# Altium schematic sheet contor.SchDoc
size A3
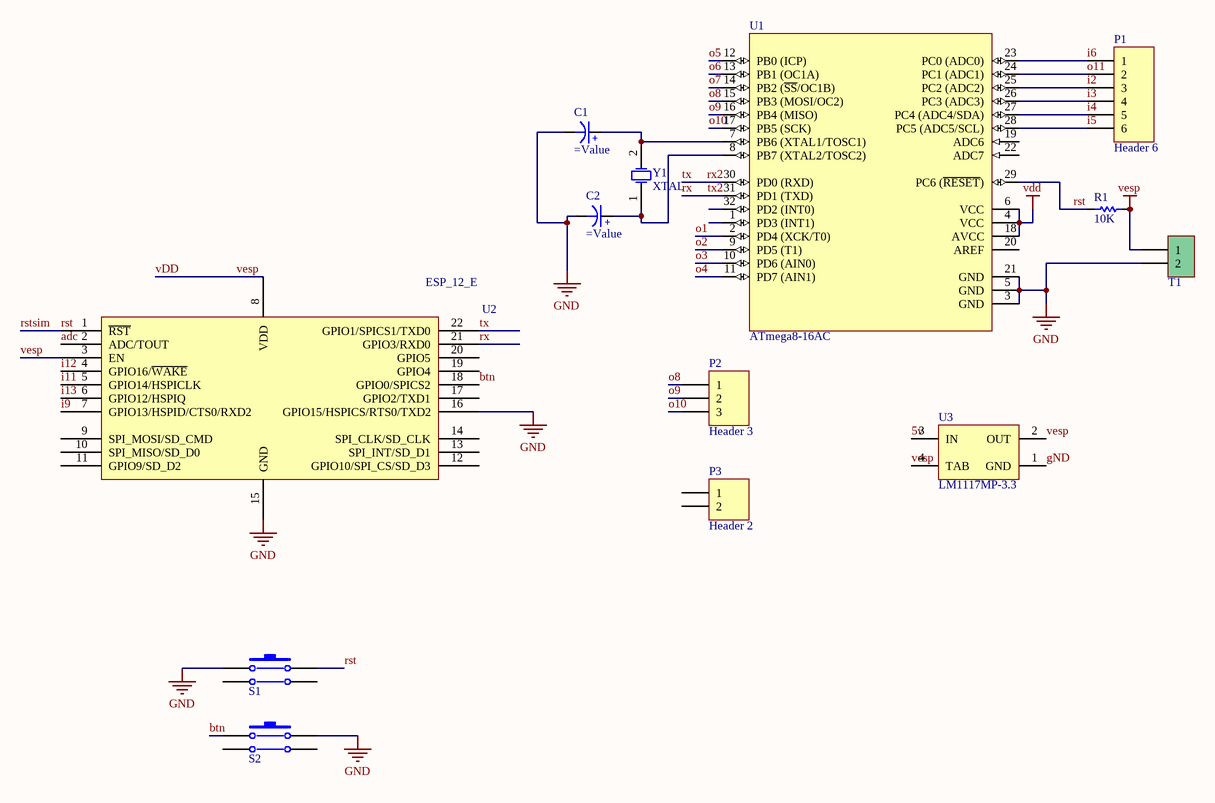
[diagram p0: contor.SchDoc]

## Parts
C1  (no value)  [ELEC-CAP-RAD10-20]
C2  (no value)  [ELEC-CAP-RAD10-20]
P1  Header 6  [HDR1X6]
P2  Header 3  [HDR1X3]
P3  Header 2  [HDR1X2]
R1  10K  [RES 1206 (3216X08L)]
S1  PUSH BUTTON DOUBLE  [PUSH BUTTON]  (value not drawn)
S2  PUSH BUTTON DOUBLE  [PUSH BUTTON]  (value not drawn)
T1  Phoenix terminal  [phoenix terminal R 2]  (value not drawn)
U1  ATmega8-16AC  [32A_N]
U2  ESP_12_E  [ESP_12_E]
U3  LM1117MP-3.3  [MP04A_N]
Y1  XTAL  [R38]

## Nets
gND: C1.1(-) C2.1(-) S1.1 S2.2 T1.2 U1.3(GND) U1.5(GND) U1.21(GND) U2.15(GND) U2.16(GPIO15/HSPICS/RTS0/TXD2) U3.1(GND)
vDD: R1.2 T1.1 U1.4(VCC) U1.6(VCC) U1.18(AVCC) U2.3(EN) U2.8(VDD) U3.2(OUT) U3.4(TAB)  [also labelled vesp]
5v: U3.3(IN)
adc: U2.2(ADC/TOUT)
btn: S2.1 U2.18(GPIO0/SPICS2)
i2: P1.3 U1.25(PC2_(ADC2))
i3: P1.4 U1.26(PC3_(ADC3))
i4: P1.5 U1.27(PC4_(ADC4/SDA))
i5: P1.6 U1.28(PC5_(ADC5/SCL))
i6: P1.1 U1.23(PC0_(ADC0))
i9: U2.7(GPIO13/HSPID/CTS0/RXD2)
i11: U2.5(GPIO14/HSPICLK)
i12: U2.4(GPIO16/~{WAKE})
i13: U2.6(GPIO12/HSPIQ)
o1: U1.2(PD4_(XCK/T0))
o2: U1.9(PD5_(T1))
o3: U1.10(PD6_(AIN0))
o4: U1.11(PD7_(AIN1))
o5: U1.12(PB0_(ICP))
o6: U1.13(PB1_(OC1A))
o7: U1.14(PB2_(~{SS}/OC1B))
o8: P2.1 U1.15(PB3_(MOSI/OC2))
o9: P2.2 U1.16(PB4_(MISO))
o10: P2.3 U1.17(PB5_(SCK))
o11: P1.2 U1.24(PC1_(ADC1))
rst: R1.1 S1.2 U1.29(PC6_(~{RESET})) U2.1(~{RST})  [also labelled rstsim]
rx: U1.31(PD1_(TXD)) U2.21(GPIO3/RXD0)  [also labelled tx2]
rx2: U1.30(PD0_(RXD)) U2.22(GPIO1/SPICS1/TXD0)  [also labelled tx]
NetC1_2: C1.2(+) U1.7(PB6_(XTAL1/TOSC1)) Y1.2(OSC2)
NetC2_2: C2.2(+) U1.8(PB7_(XTAL2/TOSC2)) Y1.1(OSC1)

Not connected (* = marked no-connect by the designer): P3 1 2; S1 3 4; S2 3 4; U1 1(PD3_(INT1)) 19(ADC6) 20(AREF) 22(ADC7) 32(PD2_(INT0)); U2 9(SPI_MOSI/SD_CMD) 10(SPI_MISO/SD_D0) 11(GPIO9/SD_D2) 12(GPIO10/SPI_CS/SD_D3) 13(SPI_INT/SD_D1) 14(SPI_CLK/SD_CLK) 17(GPIO2/TXD1) 19(GPIO4) 20(GPIO5)

## Library data of the parts
C1 C2 = Capacitor Electrolytic: Electrolytic Capacitor
P1 = Header 6: Header, 6-Pin; LatestRevisionDate: 17-Jul-2002; LatestRevisionNote: Re-released for DXP Platform.; Publisher: Altium Limited
P2 = Header 3: Header, 3-Pin; LatestRevisionDate: 17-Jul-2002; LatestRevisionNote: Re-released for DXP Platform.; Publisher: Altium Limited
P3 = Header 2: Header, 2-Pin; LatestRevisionDate: 17-Jul-2002; LatestRevisionNote: Re-released for DXP Platform.; Publisher: Altium Limited
R1 = Resistor: Tolerance: 5%; Power: 1/4 W; Value: 10K
S1 S2 = PUSH BUTTON DOUBLE: Switch
T1 = Phoenix terminal R 2: Right Terminal 2 Pin; Designer: Seyed Mohsen Ghasemain; E-mail: picpars@gmail.com; ComponentLinkURL: www.picpars.com
U1 = ATmega8-16AC: 8-Bit AVR Microcontroller with 8K Bytes of In-System Programmable Flash Memory; Published: 17-Sep-2003; LatestRevisionDate: 16-Oct-2006; LatestRevisionNote: IPC-7351 Footprint Added.; DatasheetVersion: 2486H-AVR-09/02; PackageVersion: revB, Oct-2001; PackageReference: 32A; Publisher: Altium Limited; PackageDescription: 32-Lead, 7x7x1.0 mm Body, 0.8mm Lead Pitch, Thin Profile Plastic Quad Flat Package (TQFP); Supplier 1: Digi-Key; Supplier Part Number 1: ATMEGA8-16AC-ND; Supplier 2: Mouser; Supplier Part Number 2: 556-ATMEGA8-16AC; Code_JEDEC: MS-026-ABA; ComponentLink1Description: Datasheet; ComponentLink1URL: http://www.atmel.com/dyn/resources/prod_documents/doc2486.pdf; ComponentLink2Description: Atmel.com Home; ComponentLink2URL: http://www.atmel.com
U2 = ESP_12_E: ESP-12 Wi-Fi Module by AI-Thinker; IC: ESP8266-EX; Vendor: Ai-thinker
U3 = LM1117MP-3.3: 800mA Low-Dropout Linear Regulator; Manufacturer: National Semiconductor; CompType: LDO IC; PackageTopMarking: XYTT*N05A; PowerWise: N; Published: 4-Dec-2008; DatasheetVersion: Apr-2006; PackageVersion: revB, Apr-2003; PackageReference: MP04A; Publisher: Altium Limited; PackageDescription: Molded SOT-223, 6.50 x 3.56 x 1.6mm Body, 4 Lead, 2.3mm Pitch; PartNumber: LM1117MP-3.3; RoHS: O; PinCount: 4; DigiKeyPartNumber: LM1117MP-3.3CT-ND; Code_JEDEC: TO-261-AA; Code_IPC: SOT223-4; ComponentLink1Description: LM1117 Datasheet; ComponentLink1URL: http://www.national.com/ds/LM/LM1117.pdf; ComponentLink2Description: LM1117 Web Page; ComponentLink2URL: http://www.national.com/pf/LM/LM1117.html; ComponentLink3Description: MP04A Package Page; ComponentLink3URL: http://www.national.com/packaging/folders/mp04a.html
Y1 = XTAL: Crystal Oscillator; Published: 8-Jun-2000; LatestRevisionDate: 17-Jul-2002; LatestRevisionNote: Re-released for DXP Platform.; PackageReference: R38; Publisher: Altium Limited; PackageDescription: Crystal, Thru-Hole; 2 Leads; Body 3.1 x 8.2 mm (Dia.xH)